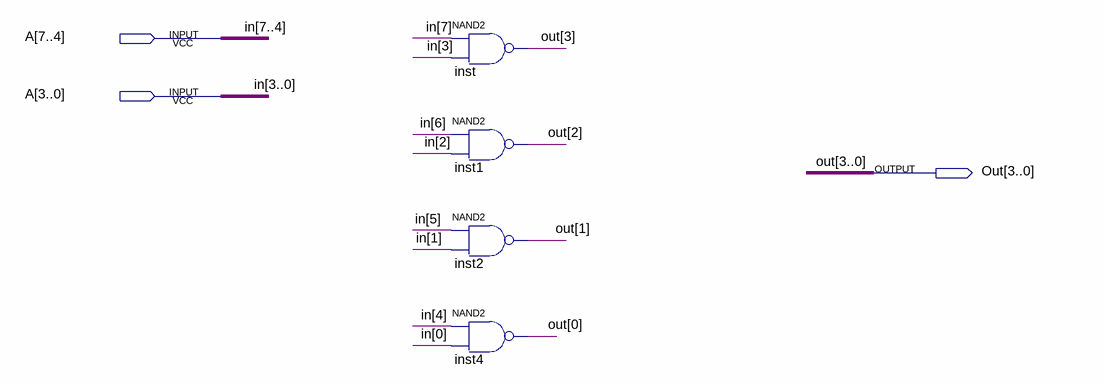
[diagram p0: schematic sheet]
// Quartus schematic bigNand.bdf as structural Verilog: 4 symbols, 3 pins
module bigNand (
  input  [7:0] A,
  output [3:0] Out
);

  nand inst (Out[3], A[7], A[3]);
  nand inst1 (Out[2], A[6], A[2]);
  nand inst2 (Out[1], A[5], A[1]);
  nand inst4 (Out[0], A[4], A[0]);

  // Other names for the same wires on the sheet: in[7:0] = A
endmodule
